# EAGLE design TanveerMPPT_02 (1) (EAGLE 7.5.0)
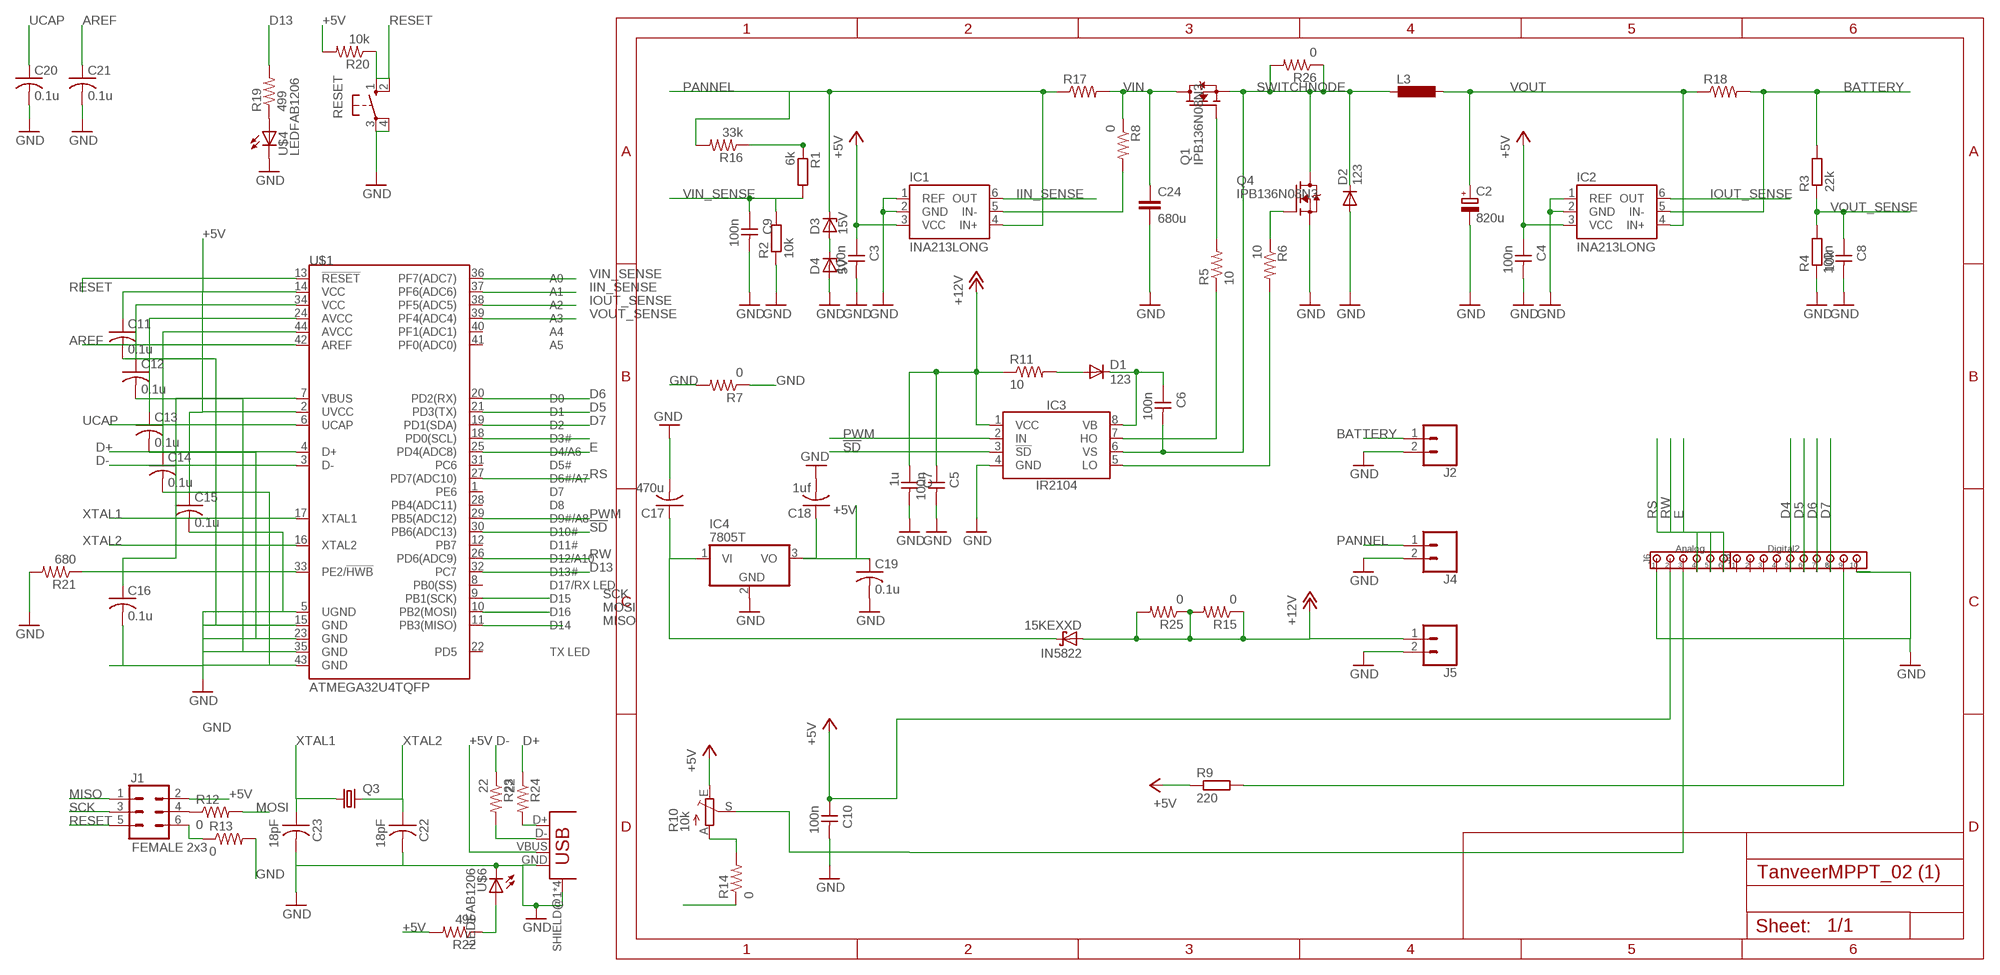
[diagram p0: schematic, sheet 1]

## Parts
C2  820u  C_POLARIZED10MM  [10MM]
C3  100n  CAP-UNPOLARIZED  [C1206]
C4  100n  CAP-UNPOLARIZEDFAB  [C1206FAB]
C5  100n  CAP-UNPOLARIZEDFAB  [C1206FAB]
C6  100n  CAP-UNPOLARIZEDFAB  [C1206FAB]
C7  1u  CAP-UNPOLARIZEDFAB  [C1206FAB]
C8  100n  CAP-UNPOLARIZED  [C1206]
C9  100n  CAP-UNPOLARIZEDFAB  [C1206FAB]
C10  100n  CAP-UNPOLARIZEDFAB  [C1206FAB]
C11  0.1u  C-USC1206  [C1206]
C12  0.1u  C-USC1206  [C1206]
C13  0.1u  C-USC1206  [C1206]
C14  0.1u  C-USC1206  [C1206]
C15  0.1u  C-USC1206  [C1206]
C16  0.1u  C-USC1206  [C1206]
C17  470u  C-USC1206  [C1206]
C18  1uf  C-USC1206  [C1206]
C19  0.1u  C-USC1206  [C1206]
C20  0.1u  C-USC1206  [C1206]
C21  0.1u  C-USC1206  [C1206]
C22  18pF  CAP-US1206FAB  [C1206FAB]
C23  18pF  CAP-US1206FAB  [C1206FAB]
C24  680u  10NF-PTH-10MM-10000V-1-%  [CAP-PTH-10MM]
D1  123  1N4004  [DO41-10]
D2  123  1N4004  [DO41-10]
D3  15V  ZENER-DIODEDO41Z10  [DO41Z10]
D4  5V  ZENER-DIODEDO41Z10  [DO41Z10]
IC1  INA213LONG  [SC70-6_LONG]
IC2  INA213LONG  [SC70-6_LONG]
IC3  IR2104  [SOIC8]
IC4  7805T  [TO220H]
IN5822  15KEXXD  [DO201T15]
J1  FEMALE 2x3  CONN_03X2FEMALE  [2X3]
J2  CONN_02PTH4  [1X02_XTRA_BIG]
J3  Digital2  100MIL_10X  [100MIL_10X_ROUND]
J4  CONN_02PTH4  [1X02_XTRA_BIG]
J5  CONN_02PTH4  [1X02_XTRA_BIG]
J6  Analog  100MIL_6X  [100MIL_6X_ROUND]
L3  L-EUIR-4  [IR-4]
Q1  IPB136N08N3  N-PWR-MOSFETTO263-3  [TO263-3]
Q3  CRYSTALTC26V  [TC26V]
Q4  IPB136N08N3  N-PWR-MOSFETTO263-3  [TO263-3]
R1  6k  R-EU_M1206  [M1206]
R2  10k  R-EU_M1206  [M1206]
R3  22k  R-EU_M1206  [M1206]
R4  10k  R-EU_M1206  [M1206]
R5  10  RES-US1206FAB  [R1206FAB]
R6  10  RES-US1206FAB  [R1206FAB]
R7  0  RES-US1206FAB  [R1206FAB]
R8  0  RES-US1206FAB  [R1206FAB]
R9  220  R-EU_M1206  [M1206]
R10  10k  TRIM_EU-B25X  [B25X]
R11  10  RES-US1206FAB  [R1206FAB]
R12  0  RES-US1206FAB  [R1206FAB]
R13  0  RES-US1206FAB  [R1206FAB]
R14  0  RES-US1206FAB  [R1206FAB]
R15  0  RES-US1206FAB  [R1206FAB]
R16  33k  RES-US1206FAB  [R1206FAB]
R17  R-US_R2512  [R2512]
R18  R-US_R2512  [R2512]
R19  499  RES-US1206FAB  [R1206FAB]
R20  10k  RES-US1206  [R1206]
R21  680  RES-US1206FAB  [R1206FAB]
R22  499  RES-US1206  [R1206]
R23  22  RES-US1206  [R1206]
R24  22  RES-US1206  [R1206]
R25  0  RES-US1206FAB  [R1206FAB]
R26  0  RES-US1206FAB  [R1206FAB]
RESET  10-XX  [B3F-10XX]
U$1  ATMEGA32U4TQFP  [SPARKFUN-DIGITALIC_TQFP44]
U$4  LEDFAB1206  [LED1206FAB]
U$5  USB_MINIB  [USB_MINIB]
U$6  LEDFAB1206  [LED1206FAB]

## Nets
!SD!: IC3.3(!SD!) U$1.30(PB6(ADC13))
+5V: C3.1 C4.1 C10.1 C11.1 C12.1 C13.1 C14.1 C15.1 C16.1 C18.1 C19.1 IC1.3(VCC) IC2.3(VCC) IC4.3(VO) J1.2 J6.2 R9.1 R10.E R20.2 R22.2 U$1.2(UVCC) U$1.7(VBUS) U$1.14(VCC) U$1.24(AVCC) U$1.34(VCC) U$1.44(AVCC) U$5.VBUS
+12V: C5.1 C7.1 IC3.1(VCC) IN5822.A J5.1 R11.1 R15.1 R15.2 R25.1 R25.2
AREF: C21.1 U$1.42(AREF)
BATTERY: IC2.5(IN-) J2.1 R3.2 R18.2
D4: J3.5 U$1.18(PD0(SCL))
D5: J3.6 U$1.21(PD3(TX))
D6: J3.7 U$1.20(PD2(RX))
D7: J3.8 U$1.19(PD1(SDA))
D13: R19.2 U$1.32(PC7)
D+: R24.1 U$1.4(D+)
D-: R23.1 U$1.3(D-)
E: J6.6 U$1.25(PD4(ADC8))
GND: C2.- C3.2 C4.2 C5.2 C7.2 C8.2 C9.2 C10.2 C11.2 C12.2 C13.2 C14.2 C15.2 C16.2 C17.2 C18.2 C19.2 C20.2 C21.2 C22.2 C23.2 C24.2 D2.A D4.A IC1.1(REF) IC1.2(GND) IC2.1(REF) IC2.2(GND) IC3.4(GND) IC4.2(GND) J2.2 J3.10 J4.2 J5.2 J6.1 Q4.3(S) R2.1 R4.1 R7.1 R7.2 R10.A R13.2 R14.1 R14.2 R21.2 RESET.3(P) RESET.4(P1) U$1.5(UGND) U$1.15(GND) U$1.23(GND) U$1.35(GND) U$1.43(GND) U$4.2(C) U$5.GND U$5.SHIELD@1(SHIELD) U$5.SHIELD@2(SHIELD) U$5.SHIELD@3(SHIELD) U$5.SHIELD@4(SHIELD) U$6.2(C)
IIN_SENSE: IC1.6(OUT) U$1.37(PF6(ADC6))
IOUT_SENSE: IC2.6(OUT) U$1.38(PF5(ADC5))
MISO: J1.1 U$1.11(PB3(MISO))
MOSI: R12.2 U$1.10(PB2(MOSI))
N$1: J1.4 R12.1
N$2: J1.6 R13.1
N$3: IC1.5(IN-) R8.2
N$4: Q1.1(G) R5.2
N$7: Q4.1(G) R6.1
N$9: J3.9 R9.2
N$10: J6.3 R10.S
N$11: D1.A R11.2
N$12: C6.1 D1.C IC3.8(VB)
N$14: IC3.7(HO) R5.1
N$15: IC3.5(LO) R6.2
N$17: R1.1 R16.1
N$19: D3.A D4.C
N$20: C17.1 IC4.1(VI) IN5822.C
N$23: R19.1 U$4.1(A)
N$24: R21.1 U$1.33(PE2/!HWB)
N$25: R24.2 U$5.D+
N$26: R22.1 U$6.1(A)
N$27: R23.2 U$5.D-
PANNEL: D3.C IC1.4(IN+) J4.1 R16.2 R17.1
PWM: IC3.2(IN) U$1.29(PB5(ADC12))
RESET: J1.5 R20.1 RESET.1(S) RESET.2(S1) U$1.13(!RESET)
RS: J6.4 U$1.27(PD7(ADC10))
RW: J6.5 U$1.26(PD6(ADC9))
SCK: J1.3 U$1.9(PB1(SCK))
SWITCHNODE: C6.2 D2.C IC3.6(VS) L3.2 Q1.3(S) Q4.TAB(D) R26.1 R26.2
UCAP: C20.1 U$1.6(UCAP)
VIN: C24.1 Q1.TAB(D) R8.1 R17.2
VIN_SENSE: C9.1 R1.2 R2.2 U$1.36(PF7(ADC7))
VOUT: C2.+ IC2.4(IN+) L3.1 R18.1
VOUT_SENSE: C8.1 R3.1 R4.2 U$1.39(PF4(ADC4))
XTAL1: C23.1 Q3.1 U$1.17(XTAL1)
XTAL2: C22.1 Q3.2 U$1.16(XTAL2)
Unconnected: J3.1 J3.2 J3.3 J3.4 U$1.1(PE6) U$1.8(PB0(SS)) U$1.12(PB7) U$1.22(PD5) U$1.28(PB4(ADC11)) U$1.31(PC6) U$1.40(PF1(ADC1)) U$1.41(PF0(ADC0))

## Library data of the parts
C2 = 00Capacitor:C_POLARIZED
C3-C10 = fab:CAP-UNPOLARIZED
C11-C21 = rcl:C-US: CAPACITOR, American symbol
C22 C23 = fab:CAP-US
C24 = SparkFun-Capacitors:10NF: 0.01uF/10nF/10,000pF ceramic capacitors A capacitor is a passive two-terminal electrical component used to store electrical energy temporarily in an electric field. CAP-09321; PROD_ID: CAP-09321; VALUE: 10nF
D1 D2 = diode:1N4004: DIODE general purpose rectifier, 1 A
D3 D4 = diode:ZENER-DIODE: Z-Diode
IC1 IC2 = 00Sensor:INA21*: Current-Shunt Monitors Voltage Output, Low- or High-Side Measurement, Bidirectional, Zero-Drift Series; GAIN: 50
IC3 = 00Logic:IR2104: Half-Bridge Driver Up to +600V Gate drive supply 10-20V Deadtime 520ns
IC4 = linear:78*: Positive VOLTAGE REGULATOR Source: http://cache.national.com/ds/LM/LM78L05.pdf http://www.fairchildsemi.com/ds/LM/LM7805.pdf
IN5822 = diode:15KEXXD: DIODE
J1 = SparkFun-Connectors:CONN_03X2: Multi connection point. Often used as Generic Header-pin footprint for 0.1 inch spaced/style header connections You can populate with any combo of single row headers, but if you'd like an exact match, check these: Header - 2x3 (Male, 0.1") <https://www.sparkfun.com/products/12807> (PRT-12807) Header - 2x3 (Female, 0.1") <https://www.sparkfun.com/products/13010> (PRT-13010) 2x3 Pin Shrouded Header <https://www.sparkfun.com/products/10877> (PRT-10877) On any of the 0.1 inch spaced packages, you can populate with these: Break Away Headers - Straight <https://www.sparkfun.com/products/116> (PRT-00116) Break Away Male Headers - Right Angle <https://www.sparkfun.com/products/553> (PRT-00553) Female Headers <https://www.sparkfun.com/products/115> (PRT-00115) Break Away Headers - Machine Pin <https://www.sparkfun.com/products/117> (PRT-00117) Break Away Female Headers - Swiss Machine Pin <https://www.sparkfun.com/products/743> (PRT-00743) Special note: the shrouded connector mates well with our 3x2 ribbon cables: Ribbon Crimp Connector - 6-pin (2x3, Female) <https://www.sparkfun.com/products/10651> (PRT-10651) Ribbon Cable - 6 wire (15ft) <https://www.sparkfun.com/products/10646> (PRT-10646); PROD_ID: CONN-11566
J2 J4 J5 = SparkFun-Connectors:CONN_02: Multi connection point. Often used as Generic Header-pin footprint for 0.1 inch spaced/style header connections On any of the 0.1 inch spaced packages, you can populate with these: Break Away Headers - Straight <https://www.sparkfun.com/products/116> (PRT-00116) Break Away Male Headers - Right Angle <https://www.sparkfun.com/products/553> (PRT-00553) Female Headers <https://www.sparkfun.com/products/115> (PRT-00115) Break Away Headers - Machine Pin <https://www.sparkfun.com/products/117> (PRT-00117) Break Away Female Headers - Swiss Machine Pin <https://www.sparkfun.com/products/743> (PRT-00743) For SCREWTERMINALS and SPRING TERMINALS visit here: Screw Terimnals on SparkFun.com <https://www.sparkfun.com/search/results?term=Screw+Terminals> (5mm/3.5mm/2.54mm spacing) This device is also useful as a general connection point to wire up your design to another part of your project. Our various solder wires solder well into these plated through hole pads. Hook-Up Wire - Assortment (Stranded, 22 AWG) <https://www.sparkfun.com/products/11375> (PRT-11375) Hook-Up Wire - Assortment (Solid Core, 22 AWG) <https://www.sparkfun.com/products/11367> (PRT-11367) View the entire wire category on our website here <https://www.sparkfun.com/categories/141> Special notes: Molex polarized connector foot print use with: PRT-08233 with associated crimp pins and housings. 2.54_SCREWTERM for use with PRT-10571. 3.5mm Screw Terminal footprints for PRT-08084 5mm Screw Terminal footprints for use with PRT-08432
J3 = 00Connector:100MIL_10X: 100mil 10-pin connector
J6 = 00Connector:100MIL_6X: 100 mil 6-pin connector
L3 = rcl:L-EU: INDUCTOR, European symbol
Q1 Q4 = 00Mosfet:N-PWR-MOSFET
Q3 = adafruit:CRYSTAL: CRYSTAL; OC_FARNELL: unknown; OC_NEWARK: unknown
R1-R4 R9 = rcl:R-EU_: RESISTOR, European symbol
R5-R8 R11-R16 R19-R26 = fab:RES-US: Resistor (US Symbol) Variants with postfix FAB are widened to allow the routing of internal traces
R10 = pot:TRIM_EU-: POTENTIOMETER
R17 R18 = resistor:R-US_: RESISTOR, American symbol
RESET = switch-omron:10-XX: OMRON SWITCH; MPN: B3F-1000; OC_FARNELL: 176432; OC_NEWARK: 36M3542
U$1 = SparkFun-Retired:ATMEGA32U4: Atmel 44-pin 8-bit Microcontroller with 32KBytes of ISP Flash and USB Controller ----- Please use the QFN-44-NOPAD_1:1 package for the footprint of all boards using a 32U4. Route traces directly away from the pads as much as possible.; PROD_ID: IC-11161
U$4 U$6 = fab:LED: LED
U$5 = fab:USB_MINIB

## Board
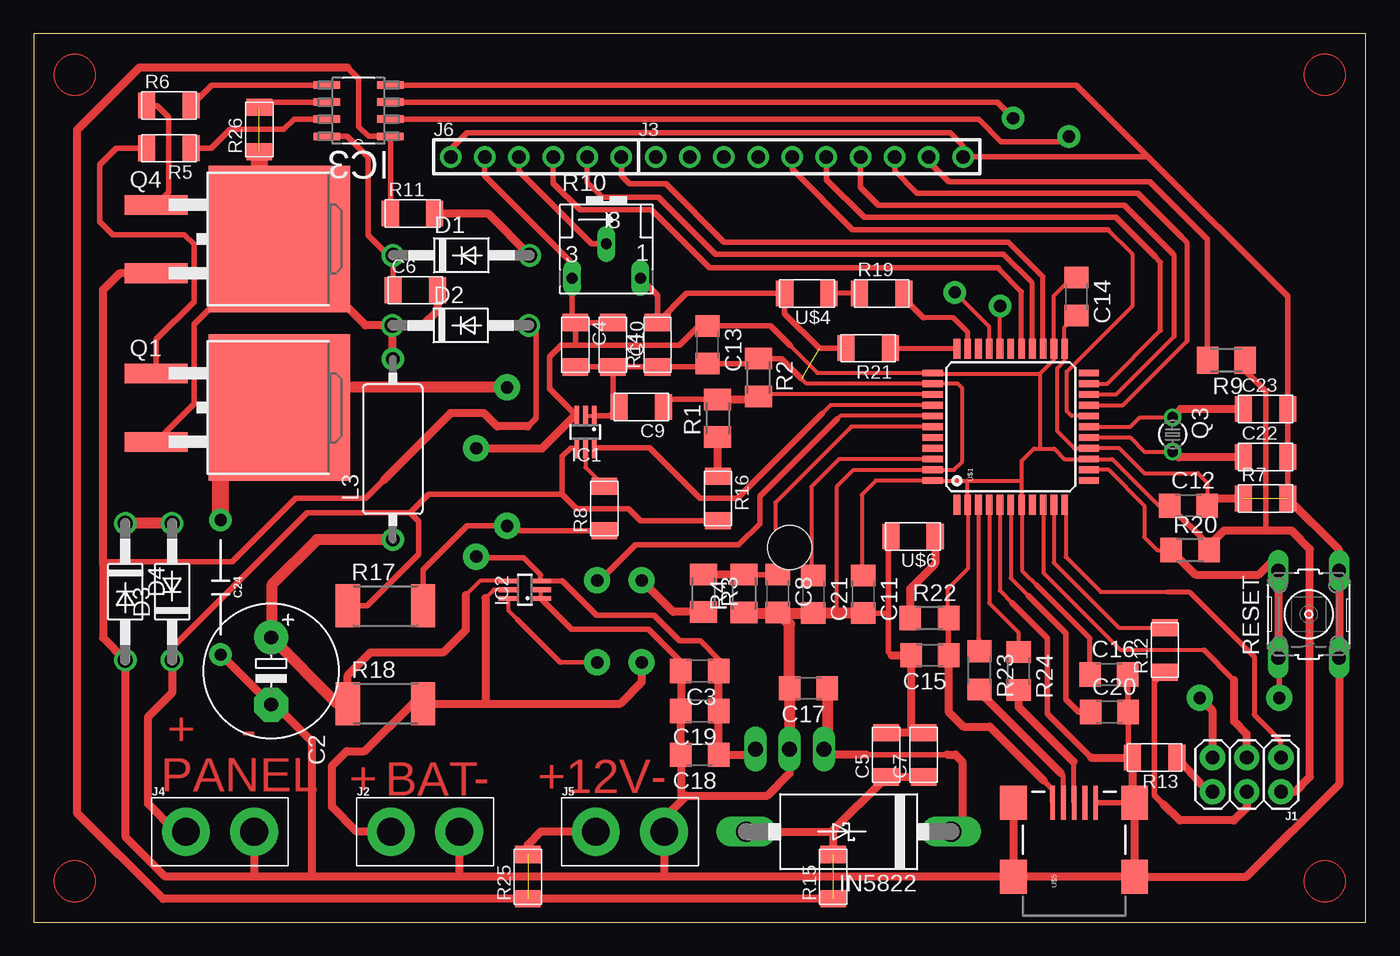
[diagram p1: board, top side]
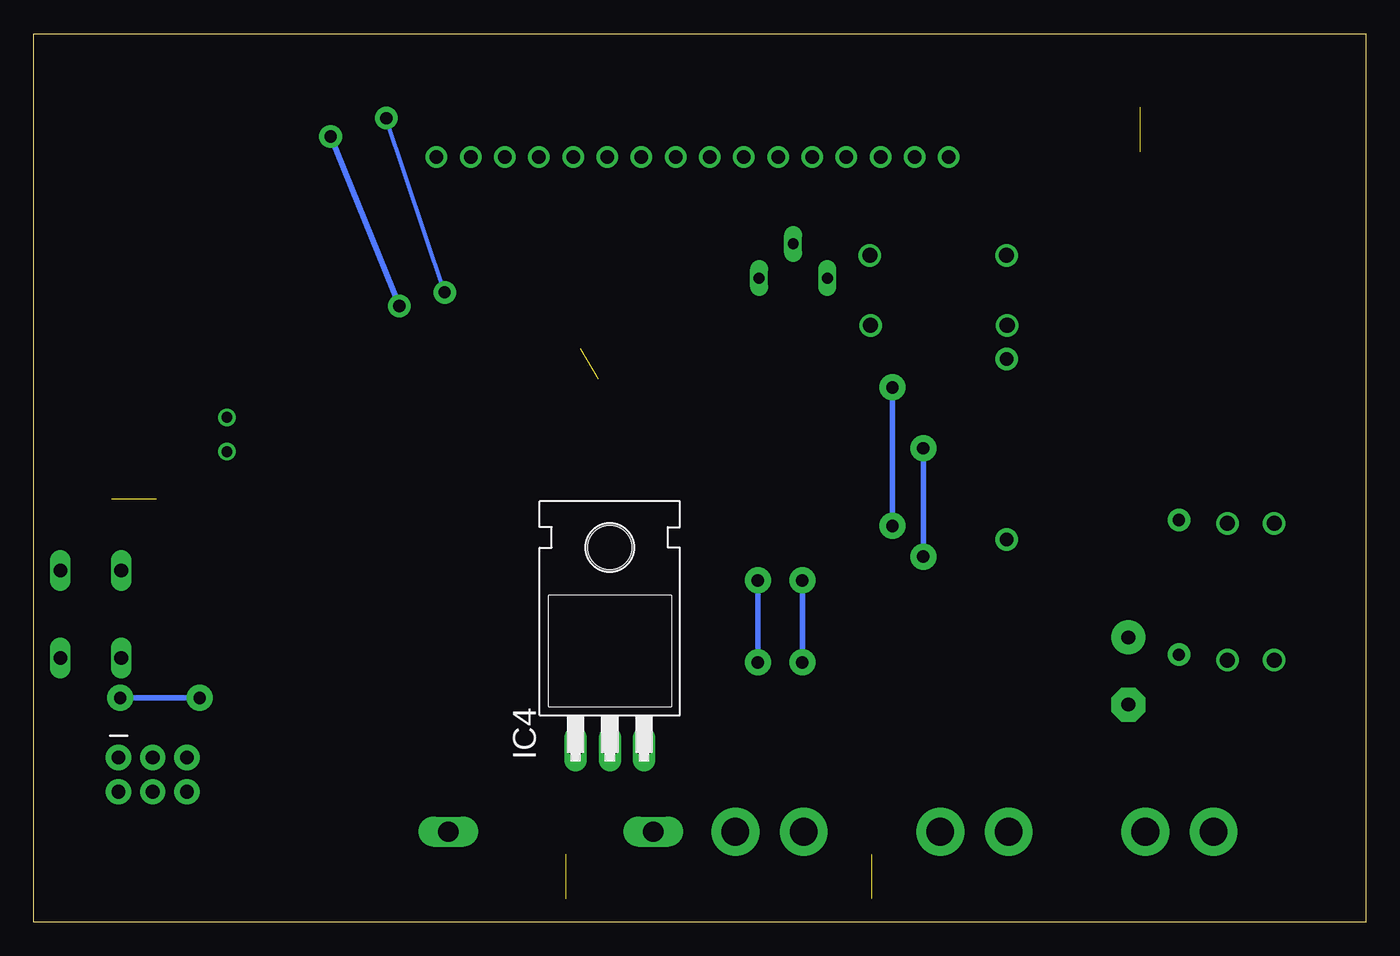
[diagram p2: board, bottom side, seen from below]

Size 99.06 x 66.04 mm. Coordinates in mm from the lower left corner, seen from the top.
Outline: 0,0 99.06,0 99.06,66.04 0,66.04 0,0
Copper layers (1*16): Top 0.035mm / dielectric 1.5mm / Bottom 0.035mm
Design rules "default": minimum track width 10mil, minimum drill 24mil, track to track 8mil, track to pad 8mil, pad to pad 8mil, via to via 8mil, smd to smd 8mil, copper to edge 40mil, drill to drill 8mil, minimum pad ring 10mil, minimum via ring 8mil, stop-mask expansion 4mil, vias tented up to drill 0mil, thermal gap 10mil

### Footprints (pad centres in the part's own frame; a part is rotated, then mirrored left to right if it is on the bottom)
10MM = drill 1.016 pad 2.54: + -2.5,0 | drill 1.016 pad 2.54 octagon: - 2.5,0
C1206 = smd 1.6 x 1.8: 1 -1.4,0; 2 1.4,0
C1206FAB = smd 1.27 x 1.905: 1 -1.651,0; 2 1.651,0
CAP-PTH-10MM = drill 0.9 pad 1.651: 1 -5,0; 2 5,0
DO41-10 = drill 1.118: A 5.08,0; C -5.08,0
DO41Z10 = drill 1.118: A 5.08,0; C -5.08,0
SC70-6_LONG = smd 0.35 x 1.5: 1 -0.65,-1.2; 2 0,-1.2; 3 0.65,-1.2; 4 0.65,1.2; 5 0,1.2; 6 -0.65,1.2
SOIC8 = smd 1.981 x 0.559: 1 -2.362,1.905; 2 -2.362,0.635; 3 -2.362,-0.635; 4 -2.362,-1.905; 5 2.362,-1.905; 6 2.362,-0.635; 7 2.362,0.635; 8 2.362,1.905
TO220H = drill 1.118 long: 1 -2.54,-10.16; 2 0,-10.16; 3 2.54,-10.16 | hole 3.302: 0,4.826
DO201T15 = drill 1.499 long: A 7.62,0; C -7.62,0
2X3 = drill 1.016 pad 1.88: 1 0,0; 2 0,2.54; 3 2.54,0; 4 2.54,2.54; 5 5.08,0; 6 5.08,2.54
1X02_XTRA_BIG = drill 2.057 pad 3.556: 1 -2.54,0; 2 2.54,0
100MIL_10X_ROUND = drill 1 pad 1.6: 1 -8.89,0; 2 -6.35,0; 3 -3.81,0; 4 -1.27,0; 5 1.27,0; 6 3.81,0; 7 6.35,0; 8 8.89,0; 9 11.43,0; 10 13.97,0
100MIL_6X_ROUND = drill 1 pad 1.6: 1 -6.35,0; 2 -3.81,0; 3 -1.27,0; 4 1.27,0; 5 3.81,0; 6 6.35,0
IR-4 = drill 1 pad 1.676: 1 -6.705,0; 2 6.73,0
TO263-3 = smd 1.45 x 4.7: 1 -2.54,-5.65; 3 2.54,-5.65 | smd 10.9 x 10.5: TAB 0,3.5
TC26V = drill 0.813: 1 -1.27,0; 2 1.27,0
M1206 = smd 1.6 x 2: 1 -1.4,0; 2 1.4,0
R1206FAB = smd 1.27 x 1.905: 1 -1.651,0; 2 1.651,0
B25X = drill 0.813 long: A 2.54,-1.905; E -2.54,-1.905; S 0,0.635
R2512 = smd 1.8 x 3.2: 1 -2.8,0; 2 2.8,0
R1206 = smd 1.6 x 1.803: 1 -1.422,0; 2 1.422,0
B3F-10XX = drill 1.016 long: 1 -3.251,2.261; 2 3.251,2.261; 3 -3.251,-2.261; 4 3.251,-2.261
SPARKFUN-DIGITALIC_TQFP44 = smd 1.5 x 0.5: 1 -5.8,4; 2 -5.8,3.2; 3 -5.8,2.4; 4 -5.8,1.6; 5 -5.8,0.8; 6 -5.8,0; 7 -5.8,-0.8; 8 -5.8,-1.6; 9 -5.8,-2.4; 10 -5.8,-3.2; 11 -5.8,-4; 23 5.8,-4; 24 5.8,-3.2; 25 5.8,-2.4; 26 5.8,-1.6; 27 5.8,-0.8; 28 5.8,0; 29 5.8,0.8; 30 5.8,1.6; 31 5.8,2.4; 32 5.8,3.2; 33 5.8,4 | smd 0.5 x 1.5: 12 -4,-5.8; 13 -3.2,-5.8; 14 -2.4,-5.8; 15 -1.6,-5.8; 16 -0.8,-5.8; 17 0,-5.8; 18 0.8,-5.8; 19 1.6,-5.8; 20 2.4,-5.8; 21 3.2,-5.8; 22 4,-5.8; 34 4,5.8; 35 3.2,5.8; 36 2.4,5.8; 37 1.6,5.8; 38 0.8,5.8; 39 0,5.8; 40 -0.8,5.8; 41 -1.6,5.8; 42 -2.4,5.8; 43 -3.2,5.8; 44 -4,5.8
LED1206FAB = smd 1.27 x 1.905: 1 -1.651,0; 2 1.651,0
USB_MINIB = smd 2.5 x 0.35: D+ 3.77,0; D- 3.77,0.8; GND 3.77,-1.6; ID 3.77,-0.8; VBUS 3.77,1.6 | smd 2.5 x 2: SHIELD@1 -1.73,-4.5; SHIELD@2 -1.73,4.5; SHIELD@3 3.77,4.5; SHIELD@4 3.77,-4.5

### Placement (x,y rotation side)
C2  17.66,18.66 270 top
C3  49.53,18.66 180 top
C4  40.28,42.91 270 top
C5  63.39,12.43 90 top
C6  28.38,46.97 0 top
C7  66.19,12.43 90 top
C8  55.33,24.43 270 top
C9  45.18,38.3 180 top
C10  43.07,42.91 270 top
C11  61.68,24.38 270 top
C12  85.86,30.95 0 top
C13  50.1,42.91 270 top
C14  77.53,46.5 270 top
C15  66.63,19.83 180 top
C16  79.94,18.41 0 top
C17  57.62,17.39 180 top
C18  49.53,12.44 180 top
C19  49.53,15.69 180 top
C20  80,15.61 0 top
C21  57.97,24.38 270 top
C22  91.6,34.57 0 top
C23  91.59,38.13 0 top
C24  13.9,24.89 270 top
D1  31.81,49.56 0 top
D2  31.75,44.36 0 top
D3  10.3,24.55 90 top
D4  6.82,24.55 270 top
IC1  41.03,36.44 180 top
IC2  36.51,24.71 90 top
IC3  24.16,60.31 180 top
IC4  56.22,23.01 0 bottom
IN5822  60.61,6.72 180 top
J1  92.75,12.23 180 top
J2  29.1,6.72 0 top
J3  55.14,56.88 0 top
J4  13.86,6.72 0 top
J5  44.34,6.72 0 top
J6  37.36,56.88 0 top
L3  26.7,35.14 90 top
Q1  14.77,38.24 270 top
Q3  84.69,36.25 270 top
Q4  14.77,50.77 270 top
R1  50.86,37.46 90 top
R2  53.91,40.48 270 top
R3  49.82,24.45 270 top
R4  52.82,24.43 90 top
R5  10.05,57.52 180 top
R6  10.05,60.69 0 top
R7  91.59,31.48 0 top
R8  42.44,30.73 90 top
R9  88.68,41.77 180 top
R10  42.58,49.78 0 top
R11  28.18,52.67 0 top
R12  84.11,20.24 90 top
R13  83.35,12.23 180 top
R14  46.39,42.91 90 top
R15  59.46,3.38 90 top
R16  50.89,31.49 270 top
R17  26.16,23.5 0 top
R18  26.16,16.24 0 top
R19  63.05,46.72 0 top
R20  85.99,27.65 0 top
R21  62.06,42.66 180 top
R22  66.61,22.6 0 top
R23  70.32,18.71 270 top
R24  73.24,18.66 270 top
R25  36.76,3.38 90 top
R26  16.78,58.91 90 top
RESET  94.8,22.89 90 top
U$1  72.65,36.82 90 top
U$4  57.5,46.72 180 top
U$5  77.36,5.11 90 top
U$6  65.38,28.67 180 top

### Tracks (layer width: path | path; a pad name or v marks a point on that pad's centre or on a via)
!SD!  (via drill 0.91 pad 1.68)
  Top 0.305: 71.04,42.63 U$1.30 71.06,44.26 v68.5,46.81
  Top 0.406: 72.41,60.19 v72.84,59.75 71.65,60.95 IC3.3
  Bottom 0.305: v68.5,46.81 v72.84,59.75
+5V  (via drill 0.91 pad 1.93)
  Top 0.305: U$1.7 73.47,31.01 | 84.46,30.98 C12.1 | U$1.24 | U$1.24 75.86,46.55 77.2,47.9 C14.1 | U$1.24 75.88,42.6 75.88,41.84 74.8,40.76 | 73.47,31.01 73.49,30.98 73.49,26.14 74.73,24.89 | 73.47,31.01 73.47,32.81 | 73.47,32.81 73.47,34.28 74.38,35.2 74.76,35.2 | 74.76,35.2 75.88,35.2 76.66,34.42 U$1.14 78.47,34.41 80.2,34.41 83.65,30.95 C12.1 | 66.86,32.81 66.87,32.81 69.43,32.81 | 69.43,32.81 73.47,32.81 | 69.43,32.81 69.43,31.05 U$1.2 69.45,26.25 67.95,24.75 67.95,22.68 R22.2 | C11.1 61.68,26.43 61.57,26.54 61.57,31.76 62.63,32.81 66.86,32.81 | 66.86,32.81 U$1.44 | 56.27,42.82 58.27,40.82 U$1.34 66.92,40.76 74.8,40.76 | C12.1 84.78,30.95 84.78,30.74 | IC2.3 | 74.8,40.76 74.8,35.24 74.76,35.2
  Top 0.356: 39.29,25.36 IC2.3 37.71,25.81 36.42,27.1 | C16.1 78.54,21.08 74.73,24.89 74.57,25.06 | U$5.VBUS 75.76,9.86 74.77,10.86 | IC1.3 40.24,37.64 40,37.4
  Top 0.406: R22.2 C15.1 | 87.41,28.01 C12.1 | R9.1 90.08,40.98 91.61,39.45 91.61,29.15 91.56,29.1 | 39.29,25.36 41.84,22.81 46.13,22.81 48.04,20.9 49.57,20.9 50.93,19.54 C3.1 | 56.27,42.82 54.77,44.31 C13.1 49.46,44.31 48.04,42.9 40.32,42.9 | J6.2 33.55,55.48 40.04,48.98 R10.E 40.04,44.8 C4.1 | 36.42,27.1 32.98,27.1 v32.91,27.17 | C4.1 C10.1 | 40.32,42.9 39.23,42.9 38.36,42.03 38.36,39.66 IC1.3 | C4.1 40.28,42.94 40.32,42.9
  Top 0.61: R20.2 87.41,28.01 88.51,29.1 91.56,29.1 93.53,29.1 94.91,27.73 94.91,10.8 93.8,9.7 J1.2 | 75.08,10.54 74.77,10.86 71.09,14.53 69.15,14.53 68.03,15.64 C15.1 | v32.91,35.22 37.82,35.22 40,37.4 40.15,37.55 | IC4.3 53.26,12.44 C18.1 C19.1 C3.1
  Bottom 0.406: v32.91,27.17 v32.91,35.22
+12V  (2 unrouted)
  Top 0.406: R11.1 26.53,57.64 IC3.1 24.9,58.41 24.17,59.14 24.17,62.68 23.34,63.51
  Top 0.61: C7.1 C5.1 59.33,6.72 | IN5822.A 59.33,6.72 | R15.2 59.46,6.59 59.33,6.72 | R15.1 R25.1 9.62,1.73 3.22,8.13 3.22,58.86 7.86,63.51 23.34,63.51 | J5.1 37.71,6.72 36.76,5.77 R25.2
AREF
  Top 0.305: 58,25.8 C21.1 57.83,25.92 57.83,32.36 59.89,34.42 U$1.42
BATTERY  (via drill 0.91 pad 1.93)
  Top 0.305: IC2.5 34.22,24.71 33.6,24.09
  Top 0.61: 33.6,24.09 33.6,16.25 | 33.6,16.25 R18.2 28.17,16.25 24.63,12.71 23.27,12.71 22.18,11.61 22.18,8.57 24.02,6.72 J2.1 | 33.6,16.25 43.62,16.25 45.21,17.84 v45.21,19.3 | R3.2 47.56,23.05 v45.21,25.4
  Bottom 0.406: v45.21,19.3 v45.21,25.4
D4
  Top 0.305: U$1.18 77.18,37.62 76.82,37.98 76.82,40.92 81.68,45.79 81.68,49.66 79.88,51.47
  Top 0.406: J3.5 56.41,55.95 60.89,51.47 79.88,51.47
D5
  Top 0.305: U$1.21 79.83,40.02 83.79,43.98
  Top 0.356: 83.79,43.98 83.79,49.05 83.39,49.45
  Top 0.406: J3.6 58.95,55.19 61.76,52.38 80.46,52.38 83.39,49.45
D6
  Top 0.305: U$1.20 80.49,39.22 84.81,43.54
  Top 0.356: 84.81,43.54 84.81,49.57 84.19,50.19
  Top 0.406: J3.7 61.49,54.63 62.82,53.3 81.09,53.3 84.19,50.19 84.71,49.68
D7
  Top 0.305: U$1.19 81,38.42 85.77,43.2
  Top 0.356: 85.77,43.2 85.77,50.51 84.68,51.6
  Top 0.406: 85.39,50.89 84.68,51.6 82.1,54.18 65.68,54.18 64.03,55.83 J3.8
D13
  Top 0.356: U$1.32 69.45,43.85 68.39,44.91 66.18,44.91
  Top 0.406: R19.2 64.7,46.39 66.18,44.91
D+
  Top 0.305: U$1.4 71.05,23.72 73.24,21.53 R24.1
D-
  Top 0.305: U$1.3 70.24,21.1 70.32,21.02 R23.1
E
  Top 0.356: U$1.25 75.06,47.98 72.48,50.55
  Top 0.406: J6.6 43.71,55.48 44.33,54.86 47.03,54.86 51.34,50.55 72.48,50.55
GND  (2 unrouted)
  Top 0.305: U$1.23 76.67,42.61 | U$1.43 | U$1.43 67.37,33.62 | 67.37,33.62 68.44,33.62 69.05,34.23 69.05,39.69 68.72,40.02 U$1.35 57.47,40.02 57.11,40.38 55.66,41.83 | C12.2 87.29,30.98 87.29,32.65 86.57,33.37 82.59,33.37 80.73,35.22 U$1.15 77.38,35.22 76.1,36.5 76.1,41.17 76.66,41.72 U$1.23 | U$1.5 71.84,24.66 72.74,23.76 | 63.53,22.98 63.56,23 | C21.2 59.24,22.98 | 66.8,33.57 U$1.43 | IC1.2 IC1.1 | U$1.23 76.66,44.22 C14.2 | 59.86,22.98 59.7,23.14 59.7,32.36 60.91,33.57 67.32,33.57 67.37,33.62 | R7.2 | IC2.2 IC2.1 | U$5.GND 79.19,8.88
  Top 0.406: 63.56,22.95 63.56,20.07 63.8,19.83 | 63.56,22.95 63.56,23 63.56,28.5 U$6.2 | 5.17,26.63 5.3,26.77 14.75,26.77 19.48,31.51 24.68,31.51 26.05,32.87 | C16.2 81.34,15.66 C20.2 81.39,12.54 R13.2 | R7.2 C22.2 93.25,38.12 C23.2 93.24,46.51 82.86,56.88 | C3.2 48.27,19.21 45.7,21.77 39.99,21.77 IC2.1 | 82.86,56.88 J3.10 69.11,57.71 68.16,58.66 32.23,58.66 31.01,57.44 J6.1 | R21.2 58.42,42.66 55.85,45.23 U$4.2 48.55,46.73 R14.2 46.39,46.6 R10.A | 82.86,56.88 77.53,62.22 IC3.4 | 79.19,8.88 U$5.SHIELD@4 | 78.65,12.23 75.39,15.49 75.39,21.11 72.74,23.76 | C11.2 63.53,22.98 63.56,22.95 | 57.11,40.38 55.61,41.88 R2.1 53.55,41.52 C13.2 49.85,41.26 R14.1 C10.2 | C10.2 C4.2 | 36.75,36.85 37.34,37.44 37.34,43.85 D2.A | C10.2 43.07,38.75 C9.2 42.87,37.64 IC1.1
  Top 0.61: U$5.SHIELD@3 U$5.SHIELD@2 | C8.2 55.33,23.49 55.87,22.95 57.95,22.95 C21.2 | C16.2 81.42,18.48 | R7.2 97.06,27.66 RESET.4 RESET.3 97.06,10.27 90.17,3.38 U$5.SHIELD@1 | R7.1 87.79,31.48 C12.2 | U$5.SHIELD@2 47.03,3.38 | 47.03,3.38 31.74,3.38 | 31.74,3.38 20.62,3.38 | 20.62,3.38 16.51,3.38 | 16.51,3.38 9.79,3.38 6.82,6.35 D4.A 5.17,21.12 5.17,26.63 5.17,47.01 6.38,48.23 Q4.3 | 81.86,8.39 U$5.SHIELD@4 | 81.86,8.39 81.7,8.55 R13.2 78.65,12.23 | U$5.SHIELD@1 U$5.SHIELD@2 | 81.86,8.39 U$5.SHIELD@1 | C7.2 65.4,14.09 | 65.4,14.09 C5.2 | 65.4,14.09 65.23,14.25 C15.2 63.8,19.83 | 47.03,3.38 46.88,3.52 J5.2 46.88,7.74 48.13,8.99 | J2.2 31.64,3.47 31.74,3.38 | 36.75,36.85 34.47,36.85 33.49,37.83 31,37.83 26.05,32.87 | J4.2 16.4,3.48 16.51,3.38 | IC4.2 56.22,11.06 54.56,9.4 48.54,9.4 48.13,8.99 | 48.13,8.99 C18.2 C19.2 C3.2 | 20.62,3.38 20.68,3.44 20.68,13.43 17.95,16.16 C2.- 13.94,19.89 C24.2
  Top 0.813: C11.2 59.86,22.98 C21.2 52.87,22.98 R4.1 | IC4.2 C17.2 56.22,22.14 C8.2 | IC4.2
IIN_SENSE
  Top 0.305: 66.82,38.44 U$1.37 59.26,38.42 58.65,37.81
  Top 0.356: IC1.6 41.96,35.24
  Top 0.406: 41.96,35.24 45.81,35.24 49.56,31.49 52.33,31.49 58.65,37.81
IOUT_SENSE  (via drill 0.91 pad 1.93)
  Top 0.305: U$1.38 66.84,37.63 59.99,37.63 59.78,37.42 | 35.96,22.5 35.31,23.15 IC2.6
  Top 0.356: v41.91,19.3 39.18,19.29 35.96,22.5
  Top 0.406: v41.91,25.4 42.13,25.4 44.77,28.04 52.42,28.04 54.01,29.62 54.01,31.66 59.78,37.42
  Bottom 0.406: v41.91,19.3 v41.91,25.4
MISO
  Top 0.305: U$1.11 76.74,30.93 76.74,27.15 79.35,24.54 84.3,24.54
  Top 0.356: 84.3,24.54 85.93,24.54 90.76,19.71 90.76,15.42 92.75,13.43 J1.1
MOSI
  Top 0.305: U$1.10 | 84.07,21.85 R12.2 80.68,21.88 75.86,26.71 U$1.10
N$1
  Top 0.305: R12.1 83.98,18.69
  Top 0.406: 84.03,8.73 83.34,9.43 83.34,17.81 R12.1
  Top 0.61: J1.4 90.21,8.52 89.25,7.55 85.21,7.55 84.03,8.73
N$2
  Top 0.61: R13.1 87.31,9.7 J1.6
N$3
  Top 0.305: IC1.5 41.03,33.8 R8.2
N$4
  Top 0.406: R5.2 6.14,57.52 4.91,56.29 4.91,52.07 5.9,51.09 11.21,51.09 11.92,50.38 11.92,46.12 9.12,43.32 Q1.1
N$7
  Top 0.406: R6.1 9.19,60.7 10.04,59.84 10.04,54.24 Q4.1
N$9
  Top 0.406: R9.2 | J3.9 66.57,56.5 68.04,55.03 83,55.03 87.28,50.75 R9.2
N$10
  Top 0.406: J6.3 36.09,55.79 41.47,50.41 R10.S
N$11
  Top 0.61: R11.2 33.78,52.67 D1.A
N$12
  Top 0.406: C6.1 D1.C 26.37,49.56 24.86,51.06 24.86,56.87 23.32,58.41 IC3.8
N$14
  Top 0.406: IC3.7 19.35,59.68 18.6,58.93 14.61,58.93 13.21,57.52 R5.1
N$15
  Top 0.406: IC3.5 13.23,62.22 R6.2
N$17
  Top 0.61: R1.1 50.86,32.91 R16.1
N$19
  Top 0.813: D3.A D4.C
N$20
  Top 0.406: 67.92,12.44 61.9,12.44
  Top 0.61: 61.9,12.44 59.17,12.44 | 67.92,12.44 68.54,12.44 69.06,11.93 69.06,7.55 IN5822.C
  Top 0.813: C17.1 59.02,13.11 IC4.1 59.17,12.44
N$23
  Top 0.356: R19.1 U$4.1
N$24
  Top 0.356: U$1.33 64.21,42.62 R21.1
N$25
  Top 0.356: U$5.D+ 77.36,11.88 76.86,12.38
  Top 0.61: R24.2 73.24,16 76.86,12.38 77.31,11.93
N$26
  Top 0.61: R22.1 65.19,24.79 67.03,26.64 U$6.1
N$27
  Top 0.356: U$5.D- 76.56,10.89 76.36,11.1
  Top 0.61: R23.2 70.32,17.14 76.36,11.1
PANNEL
  Top 0.305: IC1.4 40.18,35.24
  Top 0.406: D3.C 10.3,20.39 20.35,30.43 28.01,30.43 | R16.2 45.14,29.84 44.24,30.74 40.36,30.74 39.3,31.79 | 40.18,35.24 39.91,35.24 39.3,34.63 39.3,31.79 | R17.1 24.8,23.5 28.64,27.34 28.64,29.81 28.01,30.43 | 39.3,31.79 29.37,31.79 28.01,30.43
  Top 0.61: J4.1 10.57,6.72 8.51,8.79 8.51,15.26 10.3,17.04 D3.C
PWM  (via drill 0.91 pad 1.68)
  Top 0.305: U$1.29 v71.86,45.78
  Top 0.406: v76.97,58.4 76.59,58.02 71.94,58.02 70.28,59.68 IC3.2
  Bottom 0.406: v71.86,45.78 v76.97,58.4
RESET  (via drill 0.91 pad 1.93)
  Top 0.305: U$1.13 | U$1.13 78.48,33.65 79.89,33.65 82.59,30.95 82.59,28.62 83.55,27.65 R20.1
  Top 0.406: RESET.1 92.62,20.21 v92.62,16.67
  Top 0.61: R20.1 86.4,25.82 91.09,25.82 92.06,26.79 RESET.2 RESET.1 | J1.5 87.67,15.71 v86.71,16.67
  Bottom 0.406: v92.62,16.67 v86.71,16.67
RS
  Top 0.356: U$1.27 73.45,46.87 71.77,48.55
  Top 0.406: 71.77,48.55 71.69,48.64 50.25,48.64 45.95,52.94 40.61,52.94 38.63,54.92 J6.4
RW
  Top 0.356: U$1.26 74.25,47.52 72.12,49.65
  Top 0.406: J6.5 41.17,54.99 42.29,53.87 46.48,53.87 50.69,49.65 72.12,49.65
SCK
  Top 0.305: U$1.9 75.09,30.98 75.09,25.95 80.81,20.24 87,20.24
  Top 0.356: 89.25,17.99 87,20.24
  Top 0.61: J1.3 90.21,13.98 89.28,14.91 89.28,17.96 89.25,17.99
SWITCHNODE  (1 unrouted)
  Top 0.406: Q4.TAB 11.94,44.44 11.94,38.53 Q1.3 | IC3.6 17.16,60.95 R26.2
  Top 0.61: L3.2 26.7,44.33 D2.C | D2.C 24.68,44.35 Q4.TAB | C6.2 30.03,45.45 28.94,44.35 D2.C
  Top 1.27: R26.1 16.78,52.26 Q4.TAB
UCAP
  Top 0.305: U$1.6 72.68,31 72.66,30.97 72.66,25.57 74.07,24.15
  Top 0.406: C20.1 77.7,15.61 76.75,16.57 76.75,21.48 74.07,24.15 73.95,24.27
VIN  (via drill 0.91 pad 1.93)
  Top 0.406: R8.1 42.43,29.1 35.55,29.1 v35.2,29.45 32.22,29.45 28.96,26.2 R17.2
  Top 0.813: v35.2,39.74 19.76,39.74 Q1.TAB
  Top 1.27: C24.1 13.9,33.87 Q1.TAB
  Bottom 0.406: v35.2,39.74 v35.2,29.45
VIN_SENSE
  Top 0.305: U$1.36 54.05,39.22 R2.2
  Top 0.406: R1.2 47.38,38.86 C9.1
  Top 0.61: R1.2 53.69,38.86 R2.2
VOUT
  Top 0.305: IC2.4 33.18,25.36 32.13,24.3
  Top 0.61: 17.7,21.21 C2.+ | 32.13,24.3 32.13,21.71 30.44,20.03 25.03,20.03 23.36,18.36 R18.1
  Top 0.813: 17.7,21.21 17.7,25.06 21.07,28.43 L3.1 | R18.1 22.58,16.25 C2.+
VOUT_SENSE
  Top 0.305: 55.64,26.16 C8.1 55.15,26.04 55.15,31.18 60.79,36.82 U$1.39
  Top 0.406: R4.2 C8.1
  Top 0.61: R4.2 49.84,25.83 R3.1
XTAL1
  Top 0.305: 78.48,36.8 U$1.17 81.56,36.82 82.25,37.52 Q3.1 84.74,37.46
  Top 0.61: C23.1 85.3,38.13 Q3.1
XTAL2
  Top 0.305: 78.49,35.98 U$1.16 81.54,36.02 82.6,34.96 84.67,34.96 Q3.2 84.7,34.96 | 89.92,34.54 C22.1
  Top 0.61: 89.92,34.54 85.12,34.54 Q3.2
(copper drawn outside any net)
  shapes: Top circle x4

### Text on the board
Top: + | - | PANEL | +12V- | + | BAT | -